# EAGLE design SparkFun_SSOP16_Breakout (EAGLE 7.5.0)
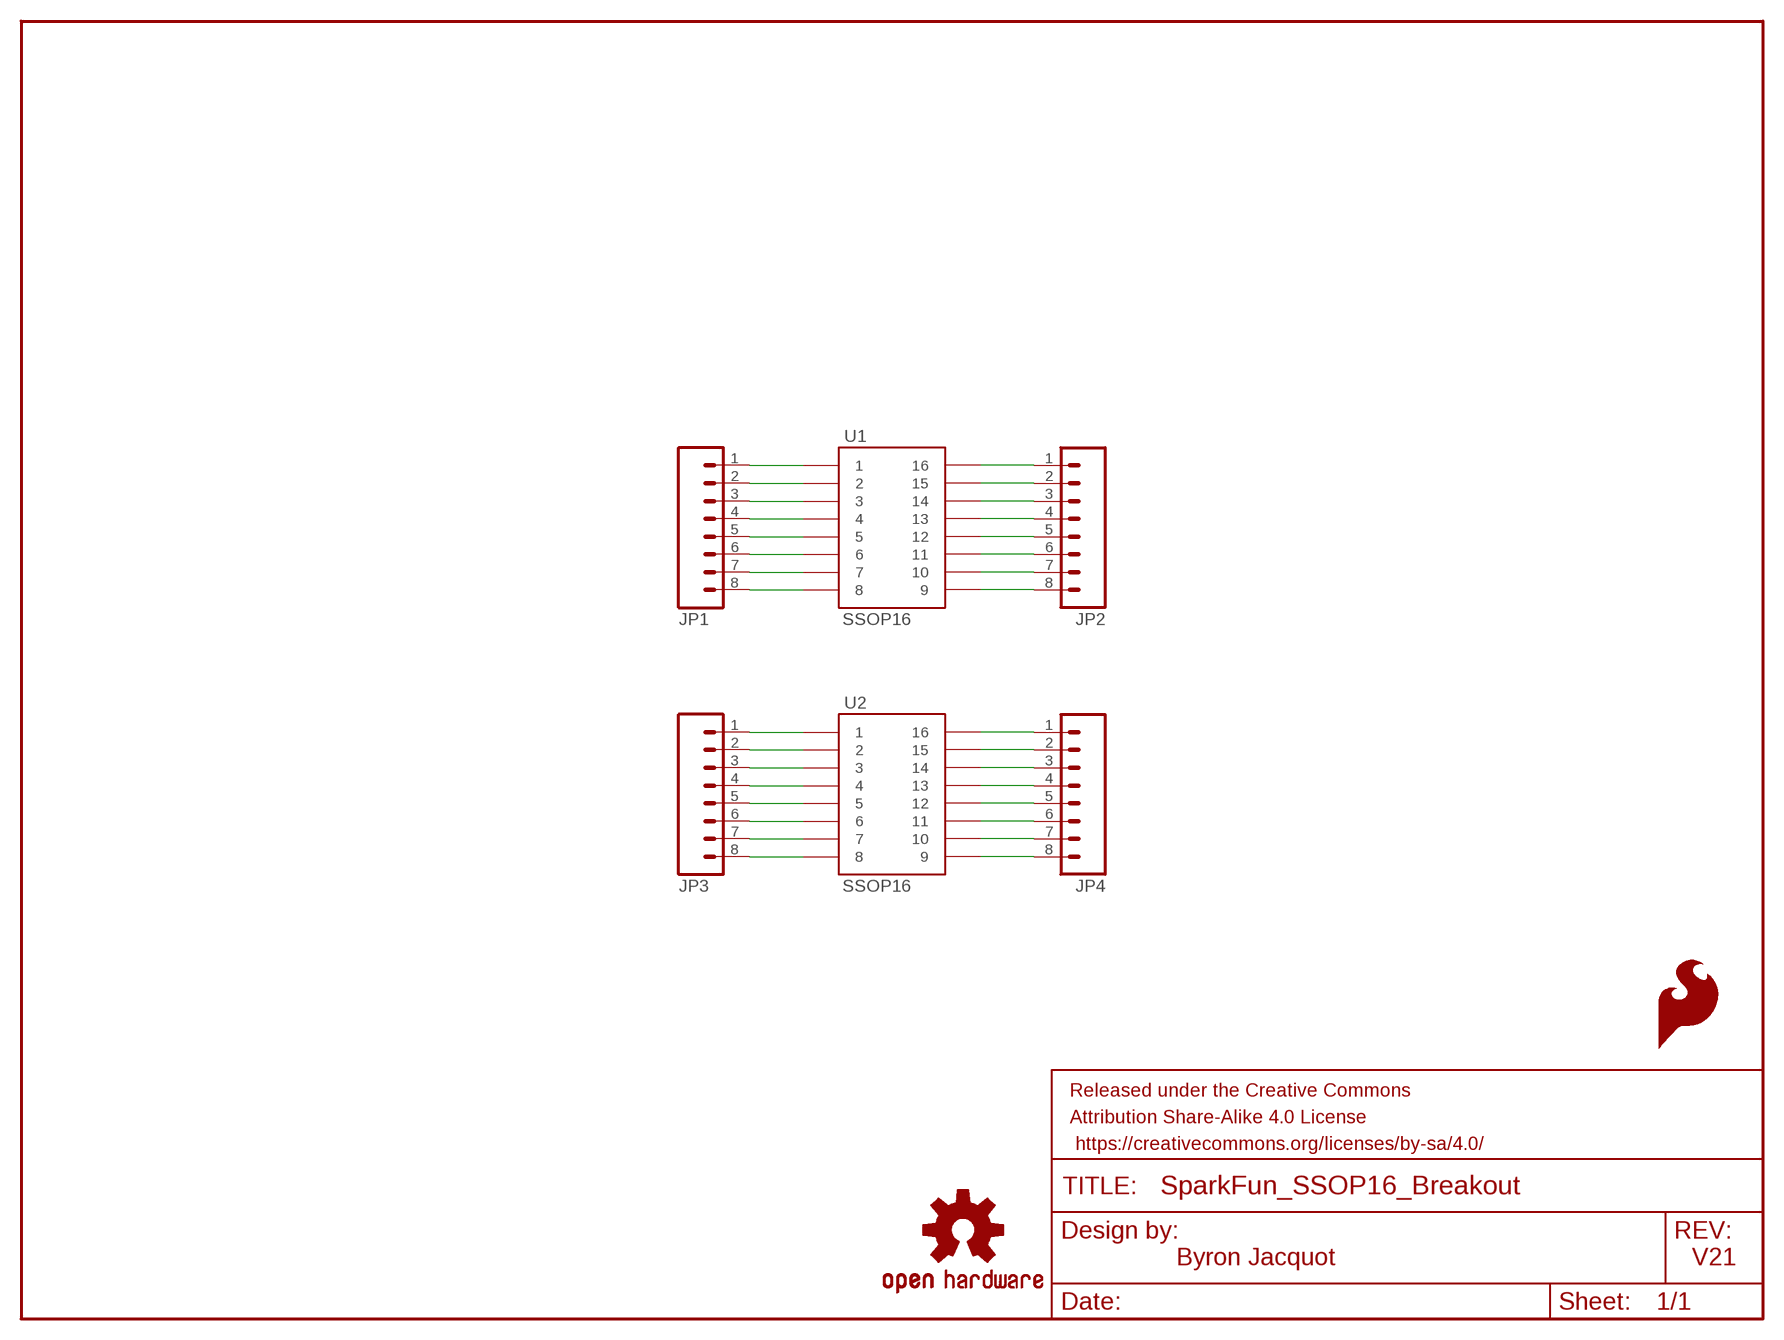
[diagram p0: schematic, sheet 1]

## Parts
FRAME1  FRAME-LETTER  [CREATIVE_COMMONS]
JP1  M08NO_SILK  [1X08_PIN1_NO_SILK]
JP2  M08NO_SILK_FEMALE_PTH  [1X08_NO_SILK]
JP3  M08NO_SILK  [1X08_PIN1_NO_SILK]
JP4  M08NO_SILK_FEMALE_PTH  [1X08_NO_SILK]
LOGO1  SFE_LOGO_FLAME.1_INCH  [SFE_LOGO_FLAME_.1]
LOGO2  SFE_LOGO_FLAME.1_INCH  [SFE_LOGO_FLAME_.1]
LOGO3  OSHW-LOGOS  [OSHW-LOGO-S]
LOGO4  OSHW-LOGOS  [OSHW-LOGO-S]
U1  SSOP16  [SSOP16]
U2  SSOP16  [SSOP16]

## Nets
N$1: JP1.1 U1.P$1
N$2: JP1.2 U1.P$2
N$3: JP1.3 U1.P$3
N$4: JP1.4 U1.P$4
N$5: JP1.5 U1.P$5
N$6: JP1.6 U1.P$6
N$7: JP1.7 U1.P$7
N$8: JP1.8 U1.P$8
N$9: JP2.1 U1.P$16
N$10: JP2.2 U1.P$15
N$11: JP2.3 U1.P$14
N$12: JP2.4 U1.P$13
N$13: JP2.5 U1.P$12
N$14: JP2.6 U1.P$11
N$15: JP2.7 U1.P$10
N$16: JP2.8 U1.P$9
N$17: JP4.1 U2.P$16
N$18: JP4.2 U2.P$15
N$19: JP4.3 U2.P$14
N$20: JP4.4 U2.P$13
N$21: JP4.5 U2.P$12
N$22: JP4.6 U2.P$11
N$23: JP4.7 U2.P$10
N$24: JP4.8 U2.P$9
N$25: JP3.1 U2.P$1
N$26: JP3.2 U2.P$2
N$27: JP3.3 U2.P$3
N$28: JP3.4 U2.P$4
N$29: JP3.5 U2.P$5
N$30: JP3.6 U2.P$6
N$31: JP3.7 U2.P$7
N$32: JP3.8 U2.P$8

## Notes on the sheet
- Byron Jacquot | V21

## Library data of the parts
FRAME1 = SparkFun-Aesthetics:FRAME-LETTER: Schematic Frame Standard 8.5x11 US Letter frame
JP1 JP3 = SparkFun-Connectors:M08: Header 8 Standard 8-pin 0.1" header. Use with straight break away headers (SKU : PRT-00116), right angle break away headers (PRT-00553), swiss pins (PRT-00743), machine pins (PRT-00117), and female headers (PRT-00115).
JP2 JP4 = SparkFun-Connectors:M08: Header 8 Standard 8-pin 0.1" header. Use with straight break away headers (SKU : PRT-00116), right angle break away headers (PRT-00553), swiss pins (PRT-00743), machine pins (PRT-00117), and female headers (PRT-00115).; PROD_ID: CONN-08438
LOGO1 LOGO2 = SparkFun-Aesthetics:SFE_LOGO_FLAME: SFE Logo, flame only This is the SparkFun flame logo. The logo on the schematic will always be the same size; the package variant is the height of the flame. Default layer for the logo on the board is tSilk.
LOGO3 LOGO4 = SparkFun-Aesthetics:OSHW-LOGO: Open Source Hardware Logo This logo indicates the piece of hardware it is found on incorporates a OSHW license and/or adheres to the definition of open source hardware found here: http://freedomdefined.org/OSHW
U1 U2 = generic-ssop16:SSOP16

## Board
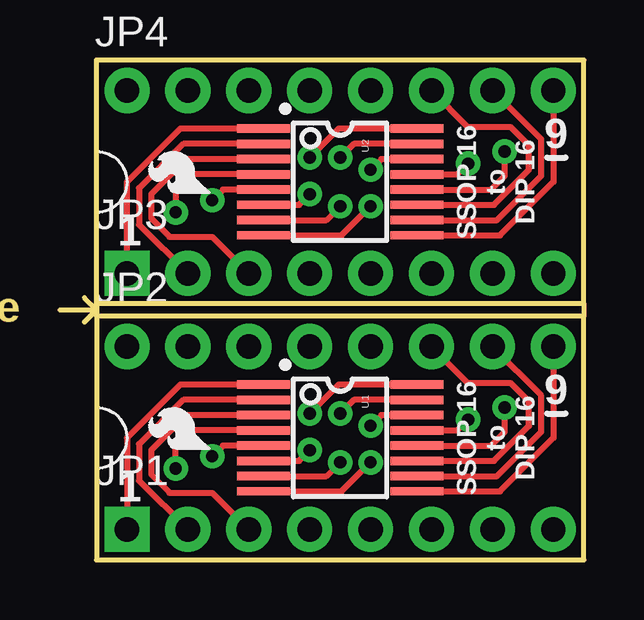
[diagram p1: board, top side]
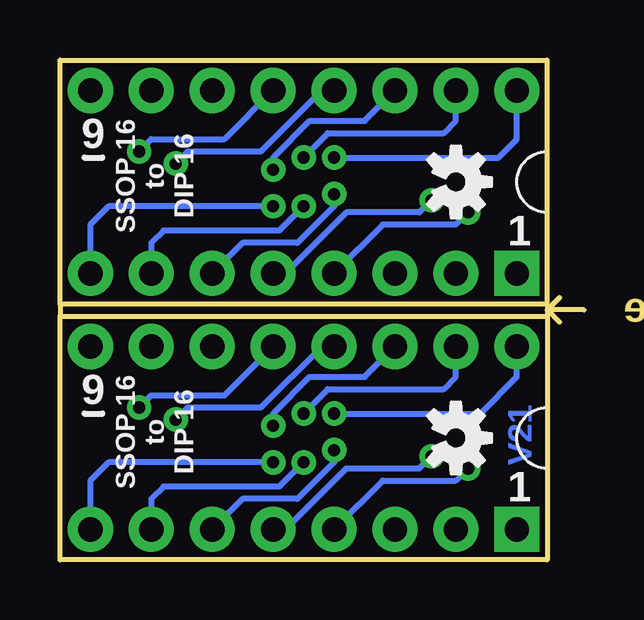
[diagram p2: board, bottom side, seen from below]

Size 21.84 x 20.83 mm. Coordinates in mm from the lower left corner, seen from the top.
Outline: 21.84,10.16 21.84,0 1.52,0 1.52,10.16
Outline: 21.84,10.16 1.52,10.16
Outline: 21.84,10.67 1.52,10.67
Outline: 21.84,10.67 21.84,20.83 1.52,20.83 1.52,10.67
Outline: 1.52,10.67 1.52,10.41
Outline: 1.52,10.41 1.52,10.16
Outline: 21.84,10.67 21.84,10.16
Outline: 1.52,10.41 1.02,9.91
Outline: 1.02,10.92 1.52,10.41
Outline: 0,10.41 1.52,10.41
Copper layers (1*16): Top 0.035mm / dielectric 1.5mm / Bottom 0.035mm
Design rules "SparkFun-2-layer-STANDARD": minimum track width 10mil, minimum drill 20mil, track to track 10mil, track to pad 8mil, pad to pad 8mil, via to via 10mil, smd to smd 8mil, copper to edge 8mil, drill to drill 8mil, minimum pad ring 10mil, minimum via ring 10mil, stop-mask expansion 4mil, vias tented up to drill 20mil, thermal gap 10mil

### Footprints (pad centres in the part's own frame; a part is rotated, then mirrored left to right if it is on the bottom)
1X08_PIN1_NO_SILK = drill 1.016 pad 1.88 square: 1 0,0 | drill 1.016 pad 1.88: 2 2.54,0; 3 5.08,0; 4 7.62,0; 5 10.16,0; 6 12.7,0; 7 15.24,0; 8 17.78,0
1X08_NO_SILK = drill 1.016 pad 1.88: 1 0,0; 2 2.54,0; 3 5.08,0; 4 7.62,0; 5 10.16,0; 6 12.7,0; 7 15.24,0; 8 17.78,0
SSOP16 = smd 0.35 x 2.2: P$1 -2.223,-3.2; P$2 -1.587,-3.2; P$3 -0.953,-3.2; P$4 -0.318,-3.2; P$5 0.318,-3.2; P$6 0.953,-3.2; P$7 1.587,-3.2; P$8 2.223,-3.2; P$9 2.223,3.2; P$10 1.587,3.2; P$11 0.953,3.2; P$12 0.318,3.2; P$13 -0.318,3.2; P$14 -0.953,3.2; P$15 -1.587,3.2; P$16 -2.223,3.2

### Placement (x,y rotation side)
FRAME1  -18.29,-20.83 0 top  (outside the outline)
JP1  2.79,1.27 0 top
JP2  2.79,8.89 0 top
JP3  2.79,11.94 0 top
JP4  2.79,19.56 0 top
LOGO1  6.6,4.32 90 top
LOGO2  6.6,14.99 90 top
LOGO3  5.33,5.08 270 bottom
LOGO4  5.33,15.75 270 bottom
U1  11.68,5.08 270 top
U2  11.68,15.75 270 top

### Tracks (layer width: path | path; a pad name or v marks a point on that pad's centre or on a via)
N$1
  Top 0.254: U1.P$1 5.02,7.3 2.79,5.08 JP1.1
N$2
  Top 0.254: JP1.2 3.3,3.3 3.3,4.83 5.14,6.67 U1.P$2
N$3
  Top 0.254: U1.P$3 5.27,6.03 3.81,4.57 3.81,3.56 4.57,2.79 6.35,2.79 JP1.3
N$4  (via drill 0.51)
  Top 0.254: v4.83,3.81 4.83,4.83 5.4,5.4 U1.P$4
  Bottom 0.254: v4.83,3.81 5.33,3.3 8.38,3.3 JP1.4
N$5  (via drill 0.51)
  Top 0.254: U1.P$5 6.79,4.76 v6.35,4.32
  Bottom 0.254: JP1.5 12.45,1.27 9.91,3.81 6.86,3.81 v6.35,4.32
N$6  (via drill 0.51)
  Top 0.254: U1.P$6 9.97,4.13 v10.41,4.57
  Bottom 0.254: v10.41,4.57 10.41,4.06 11.94,2.54 14.22,2.54 JP1.6
N$7  (via drill 0.51)
  Top 0.254: U1.P$7 11.11,3.49 v11.68,4.06
  Bottom 0.254: v11.68,4.06 12.7,3.05 17.53,3.05 18.03,2.54 JP1.7
N$8  (via drill 0.51)
  Top 0.254: U1.P$8 11.75,2.86 v12.95,4.06
  Bottom 0.254: v12.95,4.06 19.81,4.06 20.57,3.3 JP1.8
N$9  (via drill 0.51)
  Top 0.254: U1.P$16 11.62,7.3 v10.41,6.1
  Bottom 0.254: v10.41,6.1 4.32,6.1 2.79,7.62 JP2.1
N$10  (via drill 0.51)
  Top 0.254: U1.P$15 12.26,6.67 v11.68,6.1
  Bottom 0.254: v11.68,6.1 10.67,7.11 5.84,7.11 5.33,7.62 JP2.2
N$11  (via drill 0.51)
  Top 0.254: U1.P$14 13.4,6.03 v12.95,5.59
  Bottom 0.254: v12.95,5.59 12.95,6.1 11.43,7.62 9.14,7.62 JP2.3
N$12  (via drill 0.51)
  Top 0.254: U1.P$13 16.57,5.4 v17.02,5.84
  Bottom 0.254: v17.02,5.84 16.51,6.35 13.46,6.35 10.92,8.89 JP2.4
N$13  (via drill 0.51)
  Top 0.254: U1.P$12 17.97,4.76 18.54,5.33 v18.54,6.35
  Bottom 0.254: v18.54,6.35 18.03,6.86 14.99,6.86 JP2.5
N$14
  Top 0.254: U1.P$11 18.1,4.13 19.56,5.59 19.56,6.6 18.8,7.37 17.02,7.37 JP2.6
N$15
  Top 0.254: U1.P$10 18.23,3.49 20.07,5.33 20.07,6.86 JP2.7
N$16
  Top 0.254: JP2.8 20.57,5.08 18.35,2.86 U1.P$9
N$17  (via drill 0.51)
  Top 0.254: U2.P$16 11.62,17.97 v10.41,16.76
  Bottom 0.254: v10.41,16.76 3.56,16.76 2.79,17.53 JP4.1
N$18  (via drill 0.51)
  Top 0.254: U2.P$15 12.26,17.34 v11.68,16.76
  Bottom 0.254: v11.68,16.76 10.67,17.78 5.84,17.78 5.33,18.29 JP4.2
N$19  (via drill 0.51)
  Top 0.254: U2.P$14 13.4,16.7 v12.95,16.26
  Bottom 0.254: v12.95,16.26 12.95,16.76 11.43,18.29 9.14,18.29 JP4.3
N$20  (via drill 0.51)
  Top 0.254: U2.P$13 16.57,16.07 v17.02,16.51
  Bottom 0.254: v17.02,16.51 16.51,17.02 13.46,17.02 10.92,19.56 JP4.4
N$21  (via drill 0.51)
  Top 0.254: U2.P$12 17.97,15.43 18.54,16 v18.54,17.02
  Bottom 0.254: v18.54,17.02 18.03,17.53 14.99,17.53 JP4.5
N$22
  Top 0.254: U2.P$11 18.1,14.8 19.56,16.26 19.56,17.27 18.8,18.03 17.02,18.03 JP4.6
N$23
  Top 0.254: U2.P$10 18.23,14.16 20.07,16 20.07,17.53 JP4.7
N$24
  Top 0.254: JP4.8 20.57,15.75 18.35,13.53 U2.P$9
N$25
  Top 0.254: JP3.1 2.79,15.75 5.02,17.97 U2.P$1
N$26
  Top 0.254: U2.P$2 5.14,17.34 3.3,15.49 3.3,13.97 JP3.2
N$27
  Top 0.254: U2.P$3 5.27,16.7 3.81,15.24 3.81,14.22 4.57,13.46 6.35,13.46 JP3.3
N$28  (via drill 0.51)
  Top 0.254: U2.P$4 5.4,16.07 4.83,15.49 v4.83,14.48
  Bottom 0.254: v4.83,14.48 5.33,13.97 8.38,13.97 JP3.4
N$29  (via drill 0.51)
  Top 0.254: U2.P$5 6.79,15.43 v6.35,14.99
  Bottom 0.254: JP3.5 12.45,11.94 9.91,14.48 6.86,14.48 v6.35,14.99
N$30  (via drill 0.51)
  Top 0.254: U2.P$6 9.97,14.8 v10.41,15.24
  Bottom 0.254: v10.41,15.24 10.41,14.73 11.94,13.21 14.22,13.21 JP3.6
N$31  (via drill 0.51)
  Top 0.254: U2.P$7 11.11,14.16 v11.68,14.73
  Bottom 0.254: v11.68,14.73 12.7,13.72 17.53,13.72 18.03,13.21 JP3.7
N$32  (via drill 0.51)
  Top 0.254: U2.P$8 11.75,13.53 v12.95,14.73
  Bottom 0.254: v12.95,14.73 19.81,14.73 20.57,13.97 JP3.8

### Text on the board
Bottom: V21
Dimension: V-Score
tPlace: 9 | SSOP 16 / to / DIP 16 | 1 | 9 | SSOP 16 / to / DIP 16 | 1
bPlace: 9 | SSOP 16 / to / DIP 16 | 1 | 9 | SSOP 16 / to / DIP 16 | 1
Measures: Dimensional units as marked. / PCB & DIP features in inches; / SSOP footprint in mm.
tDocu: Byron Jacquot